# Altium schematic sheet 5_mcu_main.schdoc: EPS MCU Main
size A3; DrawnBy: Sara V. Martínez; Engineer: Flight; DocumentNumber: 6; Revision: V0.1; SheetNumber: 6; SheetTotal: 11; Designed by: Andre M. P. Mattos; ProjectRevision: v0.2
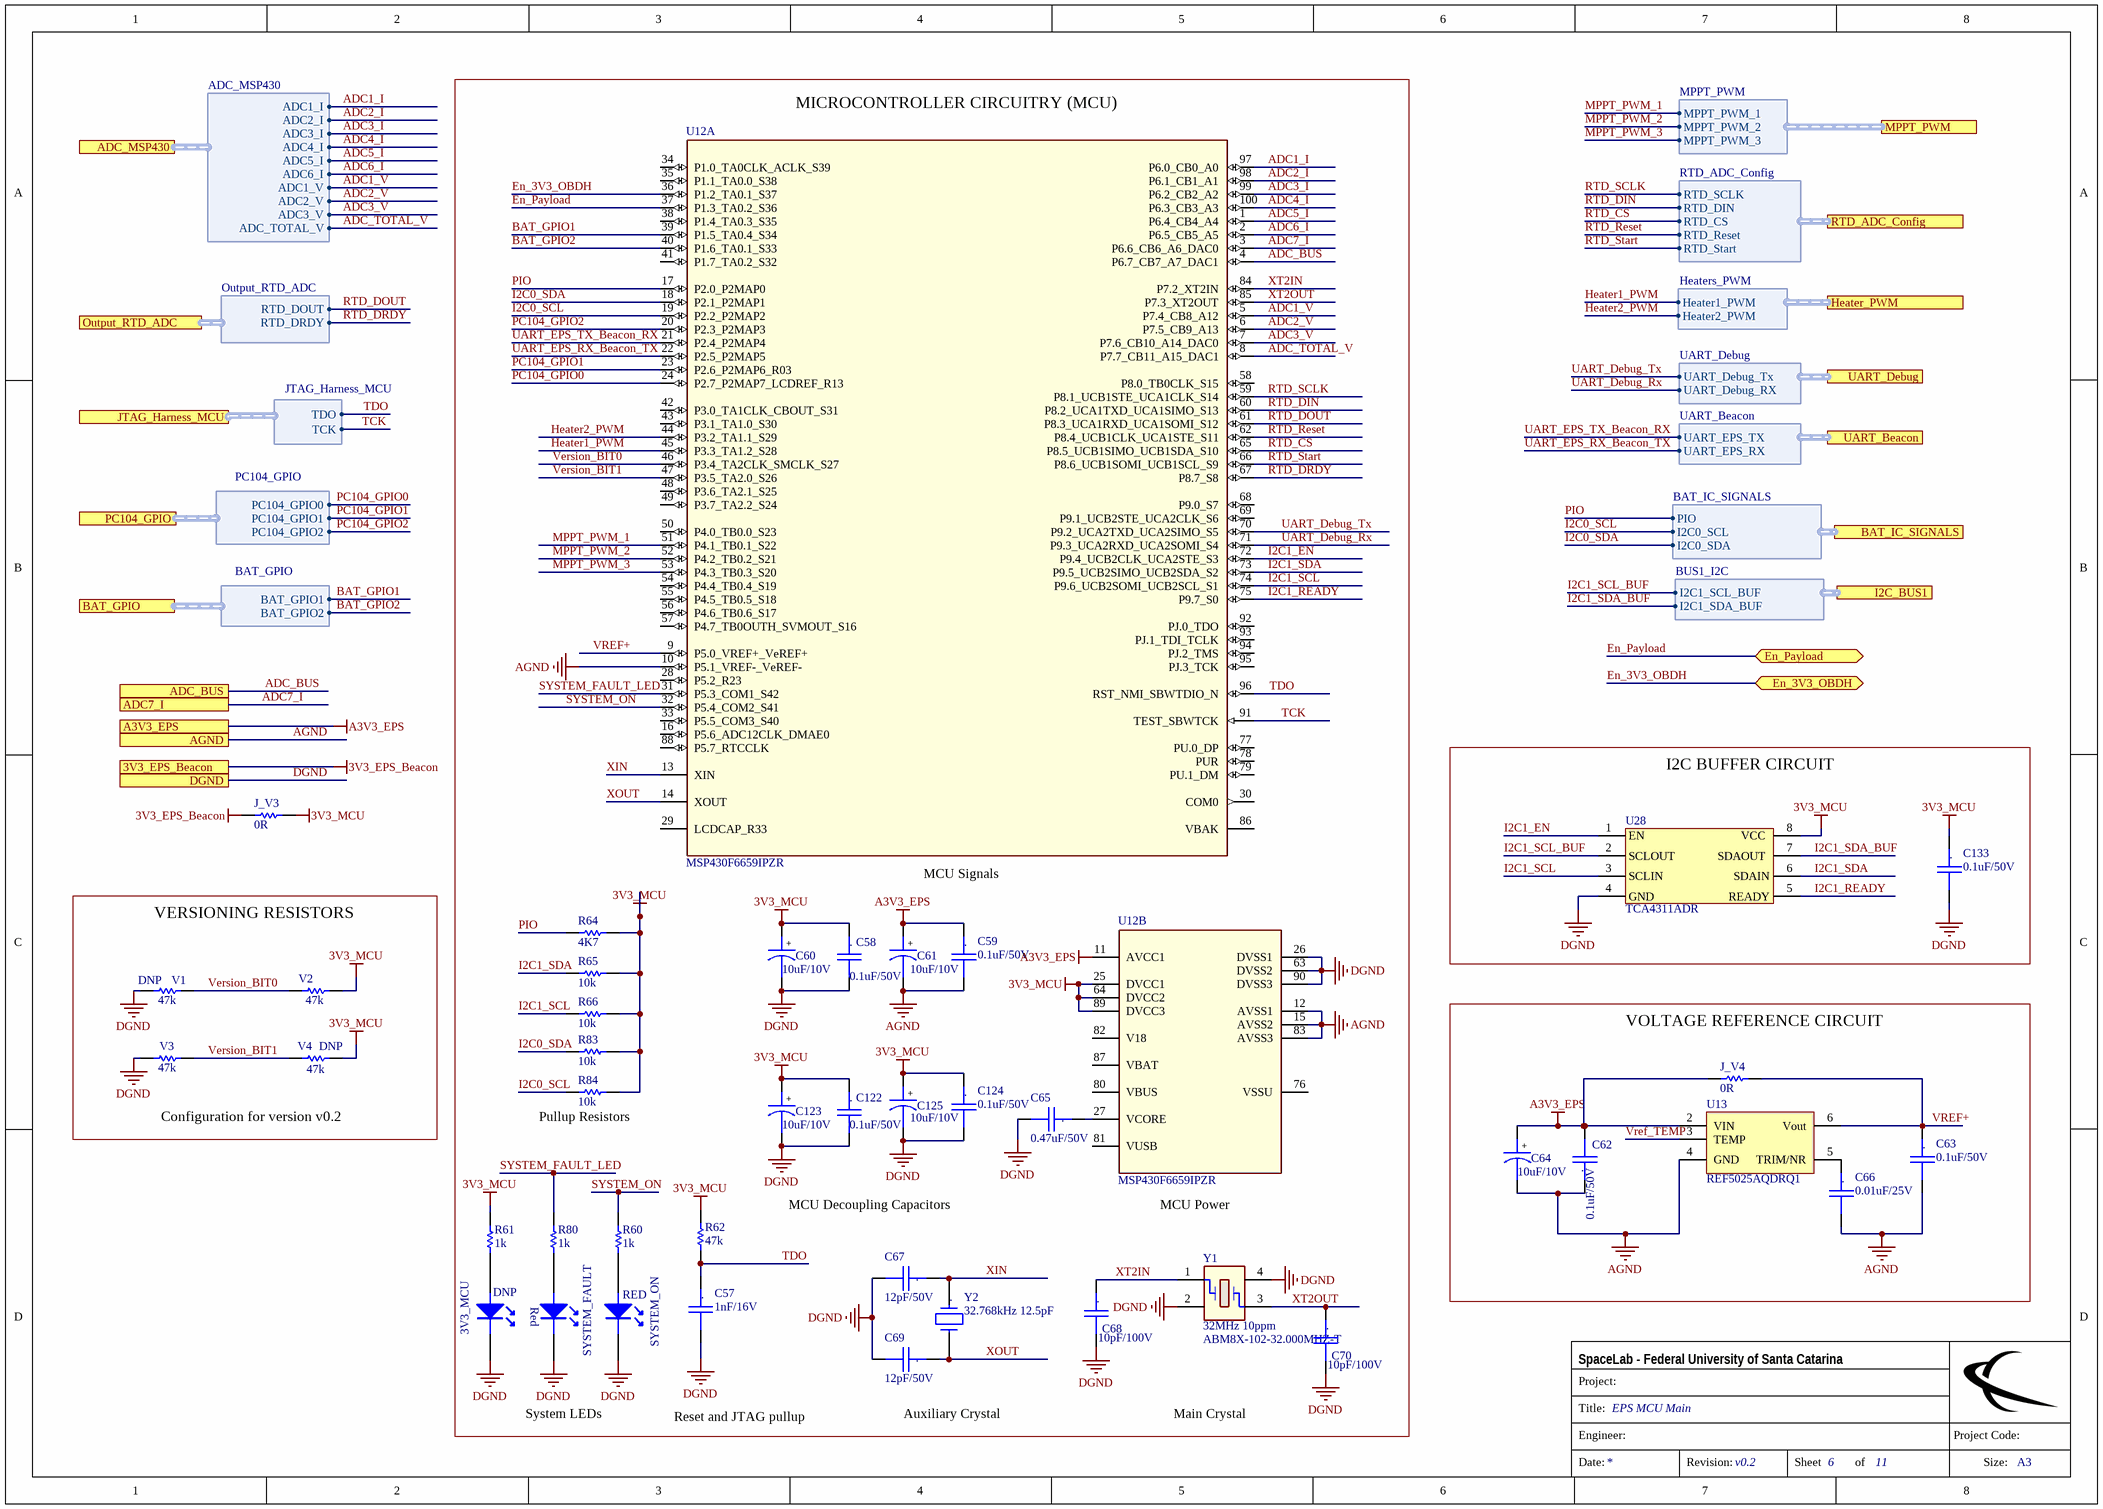
[diagram p0: 5_mcu_main.schdoc]

## Parts
3V3_MCU  DNP  [0603-LED]
C57  1nF/16V  [CC0805]
C58  0.1uF/50V  [CC0603]
C59  0.1uF/50V  [CC0603]
C60  10uF/10V  [CC0805_Tantalum]
C61  10uF/10V  [CC0805_Tantalum]
C62  0.1uF/50V  [CC0805]
C63  0.1uF/50V  [CC0603]
C64  10uF/10V  [CC0805_Tantalum]
C65  0.47uF/50V  [CC0603]
C66  0.01uF/25V  [CC0603]
C67  12pF/50V  [CC0603]
C68  10pF/100V  [CC0805]
C69  12pF/50V  [CC0603]
C70  10pF/100V  [CC0805]
C122  0.1uF/50V  [CC0603]
C123  10uF/10V  [CC0805_Tantalum]
C124  0.1uF/50V  [CC0603]
C125  10uF/10V  [CC0805_Tantalum]
C133  0.1uF/50V  [CC0603]
J_V3  0R  [0805]
J_V4  0R  [0805]
R60  1k  [0603]
R61  1k  [0603]
R62  47k  [0603]
R64  4K7  [0603]
R65  10k  [R0603]
R66  10k  [R0603]
R80  1k  [R0603]
R83  10k  [R0603]
R84  10k  [R0603]
SYSTEM_FAULT  150060RS75000  [0603-RED-LED]  (value not drawn)
SYSTEM_ON  RED  [0603-LED]
U12  MSP430F6659IPZR  [PZ0100A_N]  (parts A,B of 2)
U13  REF5025AQDRQ1  [SOIC-8]
U28  TCA4311ADR  [SOIC8]
V1  47k  [0805]
V2  47k  [0805]
V3  47k  [0805]
V4  47k  [0805]
Y1  32MHz 10ppm  Manufacturer Part Number: ABM8X-102-32.000MHZ-T  [XTAL_ABM8X]
Y2  32.768kHz 12.5pF  [ABS06 0805]

## Blocks framed on the sheet
MICROCONTROLLER CIRCUITRY (MCU): 3V3_MCU C57-C61 C65 C67-C70 C122-C125 R60-R62 R64-R66 R80 R83 R84 SYSTEM_FAULT SYSTEM_ON U12 Y1 Y2
I2C BUFFER CIRCUIT: C133 U28
VERSIONING RESISTORS: V1-V4
VOLTAGE REFERENCE CIRCUIT: C62-C64 C66 J_V4 U13

## Ports
3V3_EPS_Beacon, A3V3_EPS, ADC7_I, ADC_BUS, ADC_MSP430 (harness ADC_MSP430), AGND, BAT_GPIO (harness BAT_GPIO), BAT_IC_SIGNALS (harness BAT_IC_SIGNALS), DGND, En_3V3_OBDH (bidir), En_Payload (bidir), Heater_PWM (harness Heaters_PWM), I2C_BUS1 (harness BUS1_I2C), JTAG_Harness_MCU (harness JTAG_Harness_MCU), MPPT_PWM (harness MPPT_PWM), Output_RTD_ADC (harness Output_RTD_ADC), PC104_GPIO (harness PC104_GPIO), RTD_ADC_Config (harness RTD_ADC_Config), UART_Beacon (harness UART_Beacon), UART_Debug (harness UART_Debug)

## Harnesses
ADC_MSP430: ADC1_I, ADC2_I, ADC3_I, ADC1_V, ADC2_V, ADC3_V, ADC_TOTAL_V, ADC4_I, ADC5_I, ADC6_I
MPPT_PWM: MPPT_PWM_1, MPPT_PWM_2, MPPT_PWM_3
Output_RTD_ADC: RTD_DOUT, RTD_DRDY
RTD_ADC_Config: RTD_SCLK, RTD_DIN, RTD_CS, RTD_Reset, RTD_Start
JTAG_Harness_MCU: TDO, TCK
UART_Debug: UART_Debug_Tx, UART_Debug_RX
BUS1_I2C: I2C1_SCL_BUF, I2C1_SDA_BUF
Heaters_PWM: Heater1_PWM, Heater2_PWM
UART_Beacon: UART_EPS_TX, UART_EPS_RX
PC104_GPIO: PC104_GPIO0, PC104_GPIO1, PC104_GPIO2
BAT_GPIO: BAT_GPIO1, BAT_GPIO2
BAT_IC_SIGNALS: I2C0_SCL, I2C0_SDA, PIO

## Nets
3V3_EPS_Beacon: J_V3.2 ; port 3V3_EPS_Beacon
3V3_MCU: C58.1 C60.1 C122.1 C123.1 C124.1 C125.1 C133.1 J_V3.1 R61.2 R62.2 R64.1 R65.1 R66.1 R83.1 R84.1 U12.25(DVCC1) U12.64(DVCC2) U12.89(DVCC3) U28.8(VCC) V2.1 V4.1
A3V3_EPS: C59.1 C61.1 C62.2 C64.1 J_V4.2 U12.11(AVCC1) U13.2(VIN) ; port A3V3_EPS
AGND: C59.2 C61.2 C62.1 C63.2 C64.2 C66.2 U12.10(P5.1_VREF-_VeREF-) U12.12(AVSS1) U12.15(AVSS2) U12.83(AVSS3) U13.4(GND) ; port AGND
DGND: 3V3_MCU.2(K) C57.2 C58.2 C60.2 C65.2 C67.2 C68.2 C69.2 C70.2 C122.2 C123.2 C124.2 C125.2 C133.2 SYSTEM_FAULT.2(K) SYSTEM_ON.2(K) U12.26(DVSS1) U12.63(DVSS2) U12.90(DVSS3) U28.4(GND) V1.2 V3.2 Y1.2 Y1.4 ; port DGND
ADC1_I: U12.97(P6.0_CB0_A0) ; port ADC_MSP430.ADC1_I
ADC1_V: U12.5(P7.4_CB8_A12) ; port ADC_MSP430.ADC1_V
ADC2_I: U12.98(P6.1_CB1_A1) ; port ADC_MSP430.ADC2_I
ADC2_V: U12.6(P7.5_CB9_A13) ; port ADC_MSP430.ADC2_V
ADC3_I: U12.99(P6.2_CB2_A2) ; port ADC_MSP430.ADC3_I
ADC3_V: U12.7(P7.6_CB10_A14_DAC0) ; port ADC_MSP430.ADC3_V
ADC4_I: U12.100(P6.3_CB3_A3) ; port ADC_MSP430.ADC4_I
ADC5_I: U12.1(P6.4_CB4_A4) ; port ADC_MSP430.ADC5_I
ADC6_I: U12.2(P6.5_CB5_A5) ; port ADC_MSP430.ADC6_I
ADC7_I: U12.3(P6.6_CB6_A6_DAC0) ; port ADC7_I
ADC_BUS: U12.4(P6.7_CB7_A7_DAC1) ; port ADC_BUS
ADC_TOTAL_V: U12.8(P7.7_CB11_A15_DAC1) ; port ADC_MSP430.ADC_TOTAL_V
BAT_GPIO1: U12.39(P1.5_TA0.4_S34) ; port BAT_GPIO.BAT_GPIO1
BAT_GPIO2: U12.40(P1.6_TA0.1_S33) ; port BAT_GPIO.BAT_GPIO2
En_3V3_OBDH: U12.36(P1.2_TA0.1_S37) ; port En_3V3_OBDH
En_Payload: U12.37(P1.3_TA0.2_S36) ; port En_Payload
Heater1_PWM: U12.45(P3.3_TA1.2_S28) ; port Heater_PWM.Heater1_PWM
Heater2_PWM: U12.44(P3.2_TA1.1_S29) ; port Heater_PWM.Heater2_PWM
I2C0_SCL: R84.2 U12.19(P2.2_P2MAP2) ; port BAT_IC_SIGNALS.I2C0_SCL
I2C0_SDA: R83.2 U12.18(P2.1_P2MAP1) ; port BAT_IC_SIGNALS.I2C0_SDA
I2C1_EN: U12.72(P9.4_UCB2CLK_UCA2STE_S3) U28.1(EN)
I2C1_READY: U12.75(P9.7_S0) U28.5(READY)
I2C1_SCL: R66.2 U12.74(P9.6_UCB2SOMI_UCB2SCL_S1) U28.3(SCLIN)
I2C1_SCL_BUF: U28.2(SCLOUT) ; port I2C_BUS1.I2C1_SCL_BUF
I2C1_SDA: R65.2 U12.73(P9.5_UCB2SIMO_UCB2SDA_S2) U28.6(SDAIN)
I2C1_SDA_BUF: U28.7(SDAOUT) ; port I2C_BUS1.I2C1_SDA_BUF
MPPT_PWM_1: U12.51(P4.1_TB0.1_S22) ; port MPPT_PWM.MPPT_PWM_1
MPPT_PWM_2: U12.52(P4.2_TB0.2_S21) ; port MPPT_PWM.MPPT_PWM_2
MPPT_PWM_3: U12.53(P4.3_TB0.3_S20) ; port MPPT_PWM.MPPT_PWM_3
PC104_GPIO0: U12.24(P2.7_P2MAP7_LCDREF_R13) ; port PC104_GPIO.PC104_GPIO0
PC104_GPIO1: U12.23(P2.6_P2MAP6_R03) ; port PC104_GPIO.PC104_GPIO1
PC104_GPIO2: U12.20(P2.3_P2MAP3) ; port PC104_GPIO.PC104_GPIO2
PIO: R64.2 U12.17(P2.0_P2MAP0) ; port BAT_IC_SIGNALS.PIO
RTD_CS: U12.65(P8.5_UCB1SIMO_UCB1SDA_S10) ; port RTD_ADC_Config.RTD_CS
RTD_DIN: U12.60(P8.2_UCA1TXD_UCA1SIMO_S13) ; port RTD_ADC_Config.RTD_DIN
RTD_DOUT: U12.61(P8.3_UCA1RXD_UCA1SOMI_S12) ; port Output_RTD_ADC.RTD_DOUT
RTD_DRDY: U12.67(P8.7_S8) ; port Output_RTD_ADC.RTD_DRDY
RTD_Reset: U12.62(P8.4_UCB1CLK_UCA1STE_S11) ; port RTD_ADC_Config.RTD_Reset
RTD_SCLK: U12.59(P8.1_UCB1STE_UCA1CLK_S14) ; port RTD_ADC_Config.RTD_SCLK
RTD_Start: U12.66(P8.6_UCB1SOMI_UCB1SCL_S9) ; port RTD_ADC_Config.RTD_Start
SYSTEM_FAULT_LED: R80.2 U12.31(P5.3_COM1_S42)
SYSTEM_ON: R60.2 U12.32(P5.4_COM2_S41)
TCK: U12.91(TEST_SBWTCK) ; port JTAG_Harness_MCU.TCK
TDO: C57.1 R62.1 U12.96(RST_NMI_SBWTDIO_N) ; port JTAG_Harness_MCU.TDO
UART_Debug_Rx: U12.71(P9.3_UCA2RXD_UCA2SOMI_S4) ; port UART_Debug.UART_Debug_RX
UART_Debug_Tx: U12.70(P9.2_UCA2TXD_UCA2SIMO_S5) ; port UART_Debug.UART_Debug_Tx
UART_EPS_RX_Beacon_TX: U12.22(P2.5_P2MAP5) ; port UART_Beacon.UART_EPS_RX
UART_EPS_TX_Beacon_RX: U12.21(P2.4_P2MAP4) ; port UART_Beacon.UART_EPS_TX
Version_BIT0: U12.46(P3.4_TA2CLK_SMCLK_S27) V1.1 V2.2
Version_BIT1: U12.47(P3.5_TA2.0_S26) V3.1 V4.2
VREF+: C63.1 J_V4.1 U12.9(P5.0_VREF+_VeREF+) U13.6(Vout)
Vref_TEMP: U13.3(TEMP)
XIN: C67.1 U12.13(XIN) Y2.1
XOUT: C69.1 U12.14(XOUT) Y2.2
XT2IN: C68.1 U12.84(P7.2_XT2IN) Y1.1
XT2OUT: C70.1 U12.85(P7.3_XT2OUT) Y1.3
Net3V3_MCU_1: 3V3_MCU.1(A) R61.1
NetC65_1: C65.1 U12.27(VCORE)
NetC66_1: C66.1 U13.5(TRIM/NR)
NetR60_1: R60.1 SYSTEM_ON.1(A)
NetR80_1: R80.1 SYSTEM_FAULT.1(A)

Not connected (* = marked no-connect by the designer): U12 16(P5.6_ADC12CLK_DMAE0) 28(P5.2_R23) 29(LCDCAP_R33) 30(COM0) 33(P5.5_COM3_S40) 34(P1.0_TA0CLK_ACLK_S39) 35(P1.1_TA0.0_S38) 38(P1.4_TA0.3_S35) 41(P1.7_TA0.2_S32) 42(P3.0_TA1CLK_CBOUT_S31) 43(P3.1_TA1.0_S30) 48(P3.6_TA2.1_S25) 49(P3.7_TA2.2_S24) 50(P4.0_TB0.0_S23) 54(P4.4_TB0.4_S19) 55(P4.5_TB0.5_S18) 56(P4.6_TB0.6_S17) 57(P4.7_TB0OUTH_SVMOUT_S16) 58(P8.0_TB0CLK_S15) 68(P9.0_S7) 69(P9.1_UCB2STE_UCA2CLK_S6) 76(VSSU) 77(PU.0_DP) 78(PUR) 79(PU.1_DM) 80(VBUS) 81(VUSB) 82(V18) 86(VBAK) 87(VBAT) 88(P5.7_RTCCLK) 92(PJ.0_TDO) 93(PJ.1_TDI_TCLK) 94(PJ.2_TMS) 95(PJ.3_TCK)

## Notes on the sheet
- MCU Signals
- (near V1) DNP
- (near V4) DNP
- Configuration for version v0.2
- (near R84) Pullup Resistors
- MCU Decoupling Capacitors
- MCU Power
- System LEDs
- Reset and JTAG pullup
- Auxiliary Crystal
- Main Crystal
- Project:
- SpaceLab - Federal University of Santa Catarina
- Title:
- Engineer:
- Project Code:
- Date:
- Revision:
- Sheet
- of
- Size:
- A3
- (in symbol Cap_Cer_X7R_0.01uF_25V_0603) .
- (in symbol Cap_Cer_X7R_0.1uF_50V_0603) .
- (in symbol Cap_Cer_X7R_0.1uF_50V_0805) .
- (in symbol Cap_Cer_X7R_0.47uF_50V_0603) .
- (in symbol Cap_Cer_X7R_1nF_16V_0603) .
- (in symbol Cap_Cer_X7R_10pF_100V_0805) .
- (in symbol Cap_Cer_X7R_12pF_50V_0603) .
- (in symbol Cap_Tant_SMD_10uF_6V3_0805) +
- (in symbol LED/R_0602) Red
- (in symbol Xtal_32.768kHz_12pF_2_SMD) .

## Library data of the parts
3V3_MCU = LED/G_0603: SMD Green LED; Partnumber: 150060VS75000; Manufacturer: Wurth Electronics; Dominant Wavelength: 570nm; Forward Current: 30mA; Forward Voltage: 2V; Lens Style: Clear,Rectangular; Luminous Intensity: 40mcd; Test Current: 20mA; Viewing Angle: 140°; NCM: 8541.40.21; Case/Package: 0603; Case Code (Imperial): 0603; Case Code (Metric): 1608; Color: Green; ComponentLink1Description: https://katalog.we-online.de/led/datasheet/150060VS75000.pdf?src-supplier=Digi-Key; ComponentLink1URL: https://katalog.we-online.de/led/datasheet/150060VS75000.pdf?src-supplier=Digi-Key; Height: 0.7mm; Length: 1.6mm; Manufacturer Part Number: 150060VS75000; Max Operating Temperature: 85°C; Min Operating Temperature: -40°C; Mount: Surface Mount; Number of Pins: 2; Package Quantity: 1; Packaging: Tape and Reel; Pricing 1: 1=0.14, 10=0.138, 25=0.138, 50=0.129, 100=0.11, 250=0.11 (USD); Pricing 2: 1=0.14, 50=0.133, 100=0.114, 500=0.099 (USD); REACH SVHC: Unknown; Stock 1: 16336; Stock 2: 31910; Supplier 1: Mouser; Supplier 2: Digi-Key; Supplier Part Number 1: 710-150060VS75000; Supplier Part Number 2: 732-4980-1-ND; Wavelength: 570nm; Width: 0.8mm
C57 = Cap_Cer_X7R_1nF_16V_0603: CAP CER 1nF 16V 0603 5%; Partnumber: C0603X102J4RECAUTO; Manufacturer: KEMET; NCM: 8532.24.10; Capacitance: 1nF; Case/Package: 0603; Case Code (Imperial): 0603; Case Code (Metric): 1608; ComponentLink1Description: http://www.farnell.com/datasheets/2743686.pdf?src-supplier=Farnell; ComponentLink1URL: http://www.farnell.com/datasheets/2743686.pdf?src-supplier=Farnell; ComponentLink2Description: https://api.kemet.com/component-edge/download/datasheet/C0603X102J4RECAUTO.pdf?src-supplier=Digi-Key; ComponentLink2URL: https://api.kemet.com/component-edge/download/datasheet/C0603X102J4RECAUTO.pdf?src-supplier=Digi-Key; ComponentLink3Description: http://www.farnell.com/datasheets/2743686.pdf?src-supplier=Newark; ComponentLink3URL: http://www.farnell.com/datasheets/2743686.pdf?src-supplier=Newark; Features: Soft Termination; Manufacturer Part Number: C0603X102J4RECAUTO; Max Operating Temperature: 125°C; Min Operating Temperature: -55°C; Mount: Surface Mount; Packaging: Tape and Reel; Pricing 1: 1=0.24, 10=0.161, 100=0.081, 500=0.055, 1000=0.049, 4000=0.037 (USD); Pricing 2: 1=0.23, 10=0.154, 50=0.0926, 100=0.0781, 500=0.05346, 1000=0.04729 (USD); Ratings: AEC-Q200; Stock 1: 4509; Stock 2: 7106; Supplier 1: Mouser; Supplier 2: Digi-Key; Supplier Part Number 1: 80-C0603X102J4RECAUT; Supplier Part Number 2: 399-17840-1-ND; Tolerance: 5%; Voltage Rating: 16V
C58 C59 C63 C122 C124 C133 = Cap_Cer_X7R_0.1uF_50V_0603: CAP CER 0.1UF 50V 10% X7R 0603; Partnumber: CC0603KPX7R9BB104; Manufacturer: Yageo; Capacitance: 100nF; Supplier 1: Mouser; Supplier Part Number 1: 603-CC603KPX7R9BB104; Stock 1: 5712768; Pricing 1: 1=0.1, 10=0.065, 100=0.02, 1000=0.016, 2500=0.013, 10000=0.01 (USD); Mount: Surface Mount; Case/Package: 0603; Number of Pins: 2; Weight: 7.1E-05oz; Case Code (Imperial): 0603; Case Code (Metric): 1608; Min Operating Temperature: -55°C; Max Operating Temperature: 125°C; Tolerance: 10%; Dielectric: X7R; Packaging: Tape and Reel; Voltage Rating (DC): 50V; Voltage Rating: 50V; Termination: SMD/SMT; Composition: Ceramic; Length: 1.6mm; Height: 0.8mm; Width: 0.031inch; Thickness: 0.035inch; Depth: 0.8mm; Radiation Hardening: No; Lead Free: Lead Free; Halogen Free: Halogen Free; ComponentLink1URL: https://www.verical.com/server-webapp/html/getDatasheet?partID=653026&src-supplier=Verical; ComponentLink1Description: https://www.verical.com/server-webapp/html/getDatasheet?partID=653026&src-supplier=Verical; Supplier 2: Digi-Key; Supplier Part Number 2: 311-3567-1-ND; Stock 2: 0; Pricing 2: 1=0.1, 10=0.066, 50=0.036, 100=0.0293, 500=0.02094, 1000=0.01646, 2500=0.01496, 5000=0.01376 (USD); Manufacturer Part Number: CC0603KPX7R9BB104
C60 C61 C64 C123 C125 = Cap_Tant_SMD_10uF_6V3_0805: CAP Tantalum 10uF 6.3V 10% 0805; Partnumber: TPSR106K006R1000; Manufacturer: Kyocera AVX; Dissipation Factor: 8%; ESR (Equivalent Series Resistance): 1R; Polarity: Polar; NCM: 8532.21.11; Capacitance: 10uF; Case/Package: 0805; Case Code (Imperial): 0805; Case Code (Metric): 2012; ComponentLink1Description: http://www.avx.com/docs/Catalogs/packmark.pdf?src-supplier=Element14; ComponentLink1URL: http://www.avx.com/docs/Catalogs/packmark.pdf?src-supplier=Element14; ComponentLink2Description: http://www.farnell.com/datasheets/1441576.pdf?src-supplier=Element14; ComponentLink2URL: http://www.farnell.com/datasheets/1441576.pdf?src-supplier=Element14; ComponentLink3Description: http://datasheets.avx.com/TPS.pdf?src-supplier=Digi-Key; ComponentLink3URL: http://datasheets.avx.com/TPS.pdf?src-supplier=Digi-Key; Depth: 1.3mm; Dielectric Material: Tantalum; Features: General Purpose; Height - Seated (Max): 0.047inch; Height: 1.2mm; Lead Free: Lead Free; Length: 2.05mm; Manufacturer Part Number: TPSR106K006R1000; Max Operating Temperature: 125°C; Min Operating Temperature: -55°C; Mount: Surface Mount; Package Quantity: 1; Packaging: Tape and Reel; Pricing 1: 1=0.76, 10=0.561, 100=0.384, 500=0.304, 1000=0.256, 2500=0.237 (USD); Pricing 2: 1=0.73, 10=0.536, 50=0.429, 100=0.3678, 500=0.29114, 1000=0.24517 (USD); Radiation Hardening: No; REACH SVHC: No SVHC; Stock 1: 0; Stock 2: 0; Supplier 1: Mouser; Supplier 2: Digi-Key; Supplier Part Number 1: 581-TPSR106K006R1000; Supplier Part Number 2: 478-9265-1-ND; Termination: SMD/SMT; Tolerance: 10%; Voltage Rating: 6.3V; Width: 0.051inch
C62 = Cap_Cer_X7R_0.1uF_50V_0805: CAP CER 0.1UF 50V 10% X7R 0805; Partnumber: CC0805KRX7R9BB104; Manufacturer: Yageo; Material: Ceramic; Capacitance: 100nF; Insulation Resistance: 100GR; Supplier 1: Mouser; Supplier Part Number 1: 603-CC805KRX7R9BB104; Stock 1: 3904445; Pricing 1: 1=0.12, 10=0.087, 100=0.028, 1000=0.023, 4000=0.018, 8000=0.017 (USD); Mount: Surface Mount; Case/Package: 0805; Number of Pins: 2; Case Code (Metric): 2012; Case Code (Imperial): 0805; Min Operating Temperature: -55°C; Max Operating Temperature: 125°C; Tolerance: 10%; Dielectric: X7R; Packaging: Tape and Reel; Voltage Rating: 50V; Package Quantity: 1; Termination: SMD/SMT; Voltage: 50V; Length: 2mm; Height: 0.85mm; Depth: 1.25mm; Width: 0.049inch; Thickness: 0.033inch; Radiation Hardening: No; REACH SVHC: No SVHC; Lead Free: Lead Free; Halogen Free: Halogen Free; ComponentLink1URL: http://www.yageo.com/documents/recent/UPY-GPHC_X7R_6.3V-to-50V_8.pdf?src-supplier=Avnet; ComponentLink1Description: http://www.yageo.com/documents/recent/UPY-GPHC_X7R_6.3V-to-50V_8.pdf?src-supplier=Avnet; ComponentLink2URL: http://www.farnell.com/datasheets/1489800.pdf?src-supplier=Element14; ComponentLink2Description: http://www.farnell.com/datasheets/1489800.pdf?src-supplier=Element14; ComponentLink3URL: http://www.yageo.com/documents/recent/UPY-GPHC_X7R_6.3V-to-50V_18.pdf?src-supplier=Digi-Key; ComponentLink3Description: http://www.yageo.com/documents/recent/UPY-GPHC_X7R_6.3V-to-50V_18.pdf?src-supplier=Digi-Key; ComponentLink4URL: http://www.farnell.com/datasheets/2167236.pdf?src-supplier=Element14; ComponentLink4Description: http://www.farnell.com/datasheets/2167236.pdf?src-supplier=Element14; ComponentLink5URL: http://www.yageo.com/documents/recent/UPY-GPHC_X7R_6.3V-to-50V_8.pdf?src-supplier=Avnet+Europe; ComponentLink5Description: http://www.yageo.com/documents/recent/UPY-GPHC_X7R_6.3V-to-50V_8.pdf?src-supplier=Avnet+Europe; ComponentLink6URL: http://www.produktinfo.conrad.com/datenblaetter/425000-449999/445210-da-01-en-KERKO_CHIP_0805_X7R_0_1uF_10Proz_50VG.pdf?src-supplier=Conrad; ComponentLink6Description: http://www.produktinfo.conrad.com/datenblaetter/425000-449999/445210-da-01-en-KERKO_CHIP_0805_X7R_0_1uF_10Proz_50VG.pdf?src-supplier=Conrad; Supplier 2: Digi-Key; Supplier Part Number 2: 311-1140-1-ND; Stock 2: 544494; Pricing 2: 1=0.12, 10=0.088, 50=0.05, 100=0.0414, 500=0.02906, 1000=0.02405 (USD); Manufacturer Part Number: CC0805KRX7R9BB104
C65 = Cap_Cer_X7R_0.47uF_50V_0603: CAP CER 0.47UF 50V 10% X7R 0603; Partnumber: C1608X7R1H474K080AE; Manufacturer: TDK; Capacitance: 470nF; NCM: 8532.24.10; Case/Package: 0603; Case Code (Imperial): 0603; Case Code (Metric): 1608; ComponentLink1Description: http://www.mouser.com/ds/2/400/tdk_mlcc_commercial_general_en-542463.pdf?src-supplier=Mouser; ComponentLink1URL: http://www.mouser.com/ds/2/400/tdk_mlcc_commercial_general_en-542463.pdf?src-supplier=Mouser; ComponentLink2Description: https://product.tdk.com/info/en/catalog/datasheets/mlcc_commercial_soft_en.pdf?src-supplier=Digi-Key; ComponentLink2URL: https://product.tdk.com/info/en/catalog/datasheets/mlcc_commercial_soft_en.pdf?src-supplier=Digi-Key; ComponentLink3Description: https://product.tdk.com/info/en/catalog/spec/mlccspec_commercial_soft_en.pdf?src-supplier=Digi-Key; ComponentLink3URL: https://product.tdk.com/info/en/catalog/spec/mlccspec_commercial_soft_en.pdf?src-supplier=Digi-Key; Dielectric: X7R; Features: Soft Termination; Height: 0.8mm; Lead Free: Lead Free; Length: 0.063inch; Manufacturer Part Number: C1608X7R1H474K080AE; Max Operating Temperature: 125°C; Min Operating Temperature: -55°C; Mount: Surface Mount; Package Quantity: 4000; Packaging: Tape and Reel; Pricing 1: 1=0.35, 10=0.24, 100=0.144, 500=0.108, 1000=0.091, 4000=0.077 (USD); Pricing 2: 1=0.33, 10=0.23, 50=0.161, 100=0.1379, 500=0.10346, 1000=0.08736 (USD); Stock 1: 82530; Stock 2: 9176; Supplier 1: Mouser; Supplier 2: Digi-Key; Supplier Part Number 1: 810-C1608X7R1H474K0E; Supplier Part Number 2: 445-172485-1-ND; Termination: SMD/SMT; Thickness: 0.037inch; Tolerance: 10%; Voltage Rating (DC): 50V; Voltage Rating: 50V; Weight: 7.1E-05oz; Width: 0.8mm
C66 = Cap_Cer_X7R_0.01uF_25V_0603: CAP CER 0.01UF 25V 5% X7R 0603; Partnumber: 06033C103JAT4A; Manufacturer: Kyocera AVX; Capacitance: 10nF; NCM: 8532.24.10; Case/Package: 0603; Case Code (Imperial): 0603; Case Code (Metric): 1608; ComponentLink1Description: http://datasheets.avx.com/X7RDielectric.pdf?src-supplier=Digi-Key; ComponentLink1URL: http://datasheets.avx.com/X7RDielectric.pdf?src-supplier=Digi-Key; ComponentLink2Description: http://www.mouser.com/ds/2/40/X7RDielectric-777024.pdf?src-supplier=Mouser; ComponentLink2URL: http://www.mouser.com/ds/2/40/X7RDielectric-777024.pdf?src-supplier=Mouser; Depth: 0.81mm; Dielectric: X7R; Length: 1.6mm; Manufacturer Part Number: 06033C103JAT4A; Max Operating Temperature: 125°C; Min Operating Temperature: -55°C; Mount: Surface Mount; Number of Pins: 2; Package Quantity: 15000; Packaging: Tape and Reel; Pricing 1: 1=0.11, 10=0.078, 100=0.034, 500=0.033, 1000=0.033, 2500=0.033 (USD); Pricing 2: 1=0.1, 10=0.075, 50=0.0406, 100=0.0332, 500=0.02372, 1000=0.01863, 2500=0.01694, 5000=0.01558 (USD); Radiation Hardening: No; Stock 1: 13176; Stock 2: 28613; Supplier 1: Mouser; Supplier 2: Digi-Key; Supplier Part Number 1: 581-06033C103JAT4A; Supplier Part Number 2: 478-12681-1-ND; Termination: SMD/SMT; Thickness: 0.035inch; Tolerance: 5%; Voltage Rating (DC): 25V; Voltage Rating: 25V; Width: 0.032inch
C67 C69 = Cap_Cer_X7R_12pF_50V_0603: CAP CER 12pF 50V 0603; Partnumber: GQM1885C1H120GB01D; Manufacturer: Murata; Dielectric: C0G; Tolerance: 2%; NCM: 8532.24.10; Capacitance: 12pF; Case/Package: 0603; Case Code (Imperial): 0603; Case Code (Metric): 1608; ComponentLink1Description: http://psearch.murata.com/capacitor/product/GQM1885C1H120GB01%23.pdf?src-supplier=Avnet; ComponentLink1URL: http://psearch.murata.com/capacitor/product/GQM1885C1H120GB01%23.pdf?src-supplier=Avnet; ComponentLink2Description: http://search.murata.co.jp/Ceramy/image/img/A01X/partnumbering_e_01.pdf?src-supplier=Digi-Key; ComponentLink2URL: http://search.murata.co.jp/Ceramy/image/img/A01X/partnumbering_e_01.pdf?src-supplier=Digi-Key; Depth: 0.8mm; Height: 0.8mm; Length: 1.6mm; Manufacturer Part Number: GQM1885C1H120GB01D; Max Operating Temperature: 125°C; Min Operating Temperature: -55°C; Mount: Surface Mount; Package Quantity: 4000; Packaging: Tape and Reel; Pricing 1: 1=0.92, 10=0.703, 100=0.502, 250=0.475, 500=0.389, 1000=0.335 (USD); Pricing 2: 1=0.8, 10=0.611, 50=0.5078, 100=0.4373, 500=0.33858 (USD); Radiation Hardening: No; Stock 1: 3119; Stock 2: 550; Supplier 1: Mouser; Supplier 2: Digi-Key; Supplier Part Number 1: 81-GQM1885C1H120GB01; Supplier Part Number 2: 490-11261-1-ND; Termination: SMD/SMT; Thickness: 0.035inch; Voltage Rating (DC): 50V; Voltage Rating: 50V; Width: 0.031inch
C68 C70 = Cap_Cer_X7R_10pF_100V_0805: CAP CER 10pF 100V 0805; Partnumber: 08051A100FAT2A; Manufacturer: Kyocera AVX; Dielectric: C0G; Dissipation Factor: 10%; Tolerance: 1%; NCM: 8532.24.10; Capacitance: 10pF; Case/Package: 0805; Case Code (Imperial): 0805; Case Code (Metric): 2012; ComponentLink1Description: http://www.mouser.com/ds/2/40/C0GNP0-Dielectric-951274.pdf?src-supplier=Mouser; ComponentLink1URL: http://www.mouser.com/ds/2/40/C0GNP0-Dielectric-951274.pdf?src-supplier=Mouser; ComponentLink2Description: http://www.farnell.com/datasheets/1796416.pdf?src-supplier=Element14; ComponentLink2URL: http://www.farnell.com/datasheets/1796416.pdf?src-supplier=Element14; ComponentLink3Description: http://datasheets.avx.com/C0GNP0-Dielectric.pdf?src-supplier=Digi-Key; ComponentLink3URL: http://datasheets.avx.com/C0GNP0-Dielectric.pdf?src-supplier=Digi-Key; ComponentLink4Description: http://catalogs.avx.com/SurfaceMount.pdf?src-supplier=Digi-Key; ComponentLink4URL: http://catalogs.avx.com/SurfaceMount.pdf?src-supplier=Digi-Key; ComponentLink5Description: http://www.avxcorp.com/docs/Catalogs/ccog.pdf?src-supplier=Avnet+Europe; ComponentLink5URL: http://www.avxcorp.com/docs/Catalogs/ccog.pdf?src-supplier=Avnet+Europe; Contact Plating: Tin,Matte; Depth: 1.25mm; Height: 0.94mm; Lead Free: Lead Free; Length: 2.01mm; Manufacturer Part Number: 08051A100FAT2A; Max Operating Temperature: 125°C; Min Operating Temperature: -55°C; Mount: Surface Mount; Number of Pins: 2; Package Quantity: 4000; Packaging: Tape and Reel; Pricing 1: 1=0.39, 10=0.274, 100=0.164, 500=0.123, 1000=0.104, 2000=0.097 (USD); Pricing 2: 1=0.49, 10=0.347, 50=0.2626, 100=0.2287, 500=0.1694, 1000=0.14399 (USD); Radiation Hardening: No; REACH SVHC: No SVHC; Stock 1: 12105; Stock 2: 18206; Supplier 1: Mouser; Supplier 2: Digi-Key; Supplier Part Number 1: 581-08051A100FAT2A; Supplier Part Number 2: 478-5779-1-ND; Termination: SMD/SMT; Thickness: 0.037inch; Voltage Rating (DC): 100V; Voltage Rating: 100V; Width: 1.25mm
J_V3 J_V4 = R0R_JUMPER_1/8W_0805: RES 0R OHM 1/8W JUMPER 0805; Partnumber: CRCW08050000Z0EA; Manufacturer: Vishay; Max Power Dissipation: 125mW; Resistance: 0mR; Temperature Coefficient: 100ppm/°C; Tolerance: 1%; Voltage Rating (DC): 150V; Fitted: No (jumper resistor); Case/Package: 0805; Case Code (Imperial): 0805; Case Code (Metric): 2012; ComponentLink1Description: http://www.vishay.com/docs/20035/dcrcwe3.pdf?src-supplier=Avnet+Europe; ComponentLink1URL: http://www.vishay.com/docs/20035/dcrcwe3.pdf?src-supplier=Avnet+Europe; ComponentLink2Description: http://www.vishay.com/docs/20035/dcrcwe3.pdf?src-supplier=Distrelec; ComponentLink2URL: http://www.vishay.com/docs/20035/dcrcwe3.pdf?src-supplier=Distrelec; ComponentLink3Description: http://www.vishay.com/docs/20035/dcrcwe3.pdf?src-supplier=Mouser; ComponentLink3URL: http://www.vishay.com/docs/20035/dcrcwe3.pdf?src-supplier=Mouser; ComponentLink4Description: http://uk.rs-online.com/webdocs/0d98/0900766b80d98b26.pdf?src-supplier=RSComponents; ComponentLink4URL: http://uk.rs-online.com/webdocs/0d98/0900766b80d98b26.pdf?src-supplier=RSComponents; ComponentLink5Description: http://www.vishay.com/docs/20035/dcrcwe3.pdf?src-supplier=Future+Electronics; ComponentLink5URL: http://www.vishay.com/docs/20035/dcrcwe3.pdf?src-supplier=Future+Electronics; ComponentLink6Description: http://www.vishay.com/docs/20035/dcrcwe3.pdf?src-supplier=Allied+Electronics; ComponentLink6URL: http://www.vishay.com/docs/20035/dcrcwe3.pdf?src-supplier=Allied+Electronics; ComponentLink7Description: http://www.vishay.com/docs/20035/dcrcwe3.pdf?src-supplier=Digi-Key; ComponentLink7URL: http://www.vishay.com/docs/20035/dcrcwe3.pdf?src-supplier=Digi-Key; ComponentLink8Description: http://www.farnell.com/datasheets/2310790.pdf?src-supplier=Element14; ComponentLink8URL: http://www.farnell.com/datasheets/2310790.pdf?src-supplier=Element14; Composition: Thick Film; Contact Plating: Tin,Lead; Depth: 1.25mm; Features: Automotive AEC-Q200; Height: 0.45mm; Lead Free: Lead Free; Length: 2mm; Manufacturer Part Number: CRCW08050000Z0EA; Max Operating Temperature: 155°C; Military Standard: Not; Min Operating Temperature: -55°C; Number of Terminations: 2; Package Quantity: 1; Packaging: Tape and Reel; Power Rating: 125mW; Pricing 1: 1=0.1, 10=0.024, 100=0.01, 1000=0.007, 5000=0.004, 10000=0.004 (USD); Pricing 2: 1=0.1, 10=0.04, 25=0.0288, 50=0.022, 100=0.0162, 250=0.01236, 500=0.0099, 1000=0.00729 (USD); Radiation Hardening: No; REACH SVHC: Unknown; Stock 1: 903478; Stock 2: 399530; Supplier 1: Mouser; Supplier 2: Digi-Key; Supplier Part Number 1: 71-CRCW0805-0-E3; Supplier Part Number 2: 541-0.0ADKR-ND; Termination: SMD/SMT; Voltage Rating: 150V; Weight: 0.000194oz; Width: 1.25mm
R60 R61 = R1.0k_1%_1/8W_0603: RES 1.0K OHM 1/8W 1% 0603; Partnumber: MCT06030C1001FP500; Manufacturer: Vishay; Max Power Dissipation: 125mW; Power Rating: 100mW; Resistance: 1kR; Temperature Coefficient: 50ppm/°C; Voltage Rating (DC): 75V; NCM: 8533.21.20; Case/Package: 0603; Case Code (Imperial): 0603; Case Code (Metric): 1608; ComponentLink1Description: http://www.vishay.com/docs/28705/mcx0x0xpro.pdf?src-supplier=Digi-Key; ComponentLink1URL: http://www.vishay.com/docs/28705/mcx0x0xpro.pdf?src-supplier=Digi-Key; ComponentLink2Description: http://www.vishay.com/docs/28705/mc_pro.pdf?src-supplier=Avnet+Europe; ComponentLink2URL: http://www.vishay.com/docs/28705/mc_pro.pdf?src-supplier=Avnet+Europe; ComponentLink3Description: http://www.vishay.com/docs/28705/mc_pro.pdf?src-supplier=Avnet; ComponentLink3URL: http://www.vishay.com/docs/28705/mc_pro.pdf?src-supplier=Avnet; ComponentLink4Description: http://www.vishay.com/docs/28705/mc_pro.pdf?src-supplier=Future+Electronics; ComponentLink4URL: http://www.vishay.com/docs/28705/mc_pro.pdf?src-supplier=Future+Electronics; Composition: Thin Film; Contact Plating: Tin; Depth: 0.85mm; Height: 0.022inch; Lead Free: Lead Free; Length: 1.55mm; Manufacturer Part Number: MCT06030C1001FP500; Max Operating Temperature: 125°C; Military Standard: Not; Min Operating Temperature: -55°C; Mount: Surface Mount; Number of Terminations: 2; Package Quantity: 1; Packaging: Tape and Reel; Pricing 1: 1=0.1, 1000=0.025, 2000=0.023, 5000=0.019, 10000=0.018, 20000=0.017 (USD); Pricing 2: 1=0.17, 10=0.145, 100=0.0568, 1000=0.02376, 2500=0.02178 (USD); Radiation Hardening: No; REACH SVHC: Unknown; Stock 1: 142157; Stock 2: 268907; Supplier 1: Mouser; Supplier 2: Digi-Key; Supplier Part Number 1: 594-MCT06030C1001FP5; Supplier Part Number 2: MCT0603-1.00K-CFCT-ND; Termination: SMD/SMT; Tolerance: 1%; Voltage Rating: 75V; Weight: 7.1E-05oz; Width: 0.033inch
R62 = R47k_1%_1/8W_0603: RES 47K OHM 1/8W 0.5% 0603; Partnumber: MCT0603MD4702DP500; Manufacturer: Vishay; Max Power Dissipation: 150mW; Power Rating: 125mW; Resistance: 47kR; Temperature Coefficient: 25ppm/°C; Voltage Rating (DC): 75V; NCM: 8533.21.20; Case/Package: 0603; Case Code (Imperial): 0603; Case Code (Metric): 1608; ComponentLink1Description: http://www.farnell.com/datasheets/360042.pdf?src-supplier=Farnell; ComponentLink1URL: http://www.farnell.com/datasheets/360042.pdf?src-supplier=Farnell; ComponentLink2Description: http://www.vishay.com/docs/28760/mcat_pro.pdf?src-supplier=Digi-Key; ComponentLink2URL: http://www.vishay.com/docs/28760/mcat_pro.pdf?src-supplier=Digi-Key; Composition: Thin Film; Features: Automotive AEC-Q200,Anti-Sulfur; Height: 0.022inch; Length: 0.061inch; Manufacturer Part Number: MCT0603MD4702DP500; Max Operating Temperature: 175°C; Min Operating Temperature: -55°C; Number of Pins: 2; Number of Terminations: 2; Package Quantity: 1; Packaging: Tape and Reel; Pricing 1: 1=0.39, 10=0.224, 100=0.12, 500=0.096, 1000=0.072, 2500=0.062 (USD); Pricing 2: 1=0.41, 10=0.294, 100=0.1176, 1000=0.05797, 2500=0.05371 (USD); REACH SVHC: No SVHC; Stock 1: 1149; Stock 2: 4275; Supplier 1: Mouser; Supplier 2: Digi-Key; Supplier Part Number 1: 594-MCT0603MD4702DP5; Supplier Part Number 2: MCT0603-47K-MDCT-ND; Termination: SMD/SMT; Tolerance: 0.5%; Voltage Rating: 75V; Weight: 7.1E-05oz; Width: 0.8mm
R64 = R4.7K_1%_1/8W_0603: RES 4K7 OHM 1/8W 1% 0603; Manufacturer: Vishay Beyschlag; Manufacturer Part Number: MCT06030C4701FP500; Max Power Dissipation: 125mW; Resistance: 4.7kR; Temperature Coefficient: 50ppm/°C; Voltage Rating (DC): 75V; Case/Package: 0603; Case Code (Imperial): 0603; Case Code (Metric): 1608; ComponentLink1Description: http://www.vishay.com/docs/28705/mc_pro.pdf?src-supplier=Avnet; ComponentLink1URL: http://www.vishay.com/docs/28705/mc_pro.pdf?src-supplier=Avnet; ComponentLink2Description: http://www.vishay.com/docs/28705/mc_pro.pdf?src-supplier=Future+Electronics; ComponentLink2URL: http://www.vishay.com/docs/28705/mc_pro.pdf?src-supplier=Future+Electronics; ComponentLink3Description: http://www.vishay.com/docs/28705/mcx0x0xpro.pdf?src-supplier=Digi-Key; ComponentLink3URL: http://www.vishay.com/docs/28705/mcx0x0xpro.pdf?src-supplier=Digi-Key; Composition: Thin Film; Contact Plating: Tin; Depth: 0.85mm; Height: 0.022inch; Lead Free: Lead Free; Length: 1.55mm; Max Operating Temperature: 125°C; Military Standard: Not; Min Operating Temperature: -55°C; Mount: Surface Mount; Number of Terminations: 2; Package Quantity: 1; Packaging: Tape and Reel; Power Rating: 125mW; Pricing 1: 1=0.16, 50=0.076, 100=0.06, 500=0.034, 1000=0.023, 5000=0.019 (USD); Pricing 2: 1=0.17, 10=0.145, 100=0.0568, 1000=0.02376, 2500=0.02178 (USD); Radiation Hardening: No; REACH SVHC: No SVHC; Stock 1: 126399; Stock 2: 38031; Supplier 1: Mouser; Supplier 2: Digi-Key; Supplier Part Number 1: 594-MCT06030C4701FP5; Supplier Part Number 2: MCT0603-4.70K-CFCT-ND; Tolerance: 1%; Voltage Rating: 75V; Width: 0.033inch; Partnumber: MCT06030C4701FP500
R65 R66 R83 R84 = R10k_1%_1/8W_0603: RES 10K OHM 1/8W 1%  0603; Partnumber: MCT0603MC1002FP500; Manufacturer: Vishay Beyschlag; Power Rating: 125mW; Resistance: 10kR; Voltage Rating: 75V; NCM: 8533.21.20; Case/Package: 0603; Case Code (Imperial): 0603; Case Code (Metric): 1608; ComponentLink1Description: http://www.mouser.com/ds/2/427/mcat_pro-223602.pdf?src-supplier=Mouser; ComponentLink1URL: http://www.mouser.com/ds/2/427/mcat_pro-223602.pdf?src-supplier=Mouser; ComponentLink2Description: http://www.vishay.com/docs/28760/mcat_pro.pdf?src-supplier=Digi-Key; ComponentLink2URL: http://www.vishay.com/docs/28760/mcat_pro.pdf?src-supplier=Digi-Key; Composition: Thin Film; Height: 0.45mm; Length: 1.6mm; Manufacturer Part Number: MCT0603MC1002FP500; Max Operating Temperature: 155°C; Min Operating Temperature: -55°C; Package Quantity: 5000; Packaging: Tape and Reel; Pricing 1: 1=0.35, 10=0.258, 100=0.113, 500=0.102, 1000=0.051, 2500=0.046 (USD); Pricing 2: 1=0.35, 10=0.298, 100=0.1164, 1000=0.04871, 2500=0.04465 (USD); Stock 1: 17645; Stock 2: 63961; Supplier 1: Mouser; Supplier 2: Digi-Key; Supplier Part Number 1: 594-MCT0603MC1002FP5; Supplier Part Number 2: MCT0603-10.0K-MFCT-ND; Termination: SMD/SMT; Tolerance: 1%; Weight: 7.1E-05oz; Width: 0.8mm
R80 = R1.0k_1%_1/8W_0603: RES 1.0K OHM 1/8W 1% 0603; Partnumber: MCT06030C1001FP500; Manufacturer: Vishay; Resistance: 1kR; Temperature Coefficient: 50ppm/°C; Power Rating: 100mW; Voltage Rating: 75V; Max Power Dissipation: 125mW; NCM: 8533.21.20; Supplier 1: Mouser; Supplier Part Number 1: 594-MCT06030C1001FP5; Stock 1: 142157; Pricing 1: 1=0.1, 1000=0.025, 2000=0.023, 5000=0.019, 10000=0.018, 20000=0.017 (USD); Mount: Surface Mount; Case/Package: 0603; Weight: 7.1E-05oz; Contact Plating: Tin; Case Code (Metric): 1608; Case Code (Imperial): 0603; Min Operating Temperature: -55°C; Max Operating Temperature: 125°C; Tolerance: 1%; Composition: Thin Film; Package Quantity: 1; Packaging: Tape and Reel; Number of Terminations: 2; Termination: SMD/SMT; Military Standard: Not; Voltage Rating (DC): 75V; Length: 1.55mm; Height: 0.022inch; Width: 0.033inch; Depth: 0.85mm; Radiation Hardening: No; REACH SVHC: Unknown; Lead Free: Lead Free; ComponentLink1URL: http://www.vishay.com/docs/28705/mcx0x0xpro.pdf?src-supplier=Digi-Key; ComponentLink1Description: http://www.vishay.com/docs/28705/mcx0x0xpro.pdf?src-supplier=Digi-Key; ComponentLink2URL: http://www.vishay.com/docs/28705/mc_pro.pdf?src-supplier=Avnet+Europe; ComponentLink2Description: http://www.vishay.com/docs/28705/mc_pro.pdf?src-supplier=Avnet+Europe; ComponentLink3URL: http://www.vishay.com/docs/28705/mc_pro.pdf?src-supplier=Avnet; ComponentLink3Description: http://www.vishay.com/docs/28705/mc_pro.pdf?src-supplier=Avnet; ComponentLink4URL: http://www.vishay.com/docs/28705/mc_pro.pdf?src-supplier=Future+Electronics; ComponentLink4Description: http://www.vishay.com/docs/28705/mc_pro.pdf?src-supplier=Future+Electronics; Supplier 2: Digi-Key; Supplier Part Number 2: MCT0603-1.00K-CFCT-ND; Stock 2: 268907; Pricing 2: 1=0.17, 10=0.145, 100=0.0568, 1000=0.02376, 2500=0.02178 (USD); Manufacturer Part Number: MCT06030C1001FP500
SYSTEM_FAULT = LED/R_0602: Red 625nm LED Indication - Discrete 2V 0603 (1608 Metric); NCM: 8541.40.21; Partnumber: 150060RS75000
SYSTEM_ON = LED/R_0603: SMD Red LED; Partnumber: LTST-C191KFKT; Manufacturer: Vishay Lite-On; Dominant Wavelength: 605nm; Forward Current: 30mA; Forward Voltage: 2V; Illumination Color: Orange; Lens Color: Colorless; Lens Style: Diffused,Colorless,Rectangular; Lens Transparency: Clear; Luminous Intensity: 90mcd; Number of Elements: 1; Power Dissipation: 75mW; Reverse Voltage: 5V; Test Current: 20mA; Viewing Angle: 130°; Wavelength: 611nm; NCM: 8541.40.21; Case/Package: 0603; Case Code (Imperial): 0603; Case Code (Metric): 1608; Color: Orange; ComponentLink1Description: http://optoelectronics.liteon.com/upload/download/DS22-2000-222/LTST-C191KFKT.pdf?src-supplier=Digi-Key; ComponentLink1URL: http://optoelectronics.liteon.com/upload/download/DS22-2000-222/LTST-C191KFKT.pdf?src-supplier=Digi-Key; ComponentLink2Description: http://www.mouser.com/ds/2/239/liteon_ltst-c191gkt-371200.pdf?src-supplier=Mouser; ComponentLink2URL: http://www.mouser.com/ds/2/239/liteon_ltst-c191gkt-371200.pdf?src-supplier=Mouser; ComponentLink3Description: https://www.verical.com/server-webapp/html/getDatasheet?partID=631075&src-supplier=Verical; ComponentLink3URL: https://www.verical.com/server-webapp/html/getDatasheet?partID=631075&src-supplier=Verical; Depth: 0.8mm; Height: 0.55mm; Lead Free: Lead Free; Length: 1.6mm; Manufacturer Part Number: LTST-C191KFKT; Max Operating Temperature: 85°C; Min Operating Temperature: -55°C; Mount: Surface Mount; Number of LEDs: 1; Number of Pins: 2; Package Quantity: 1; Packaging: Tape and Reel; Power Rating: 75mW; Pricing 1: 1=0.25, 10=0.13, 100=0.061, 1000=0.045, 5000=0.038, 10000=0.034 (USD); Pricing 2: 1=0.24, 10=0.179, 100=0.0846, 500=0.0564, 1000=0.04418, 2500=0.04324 (USD); Radiation Hardening: No; Stock 1: 15603; Stock 2: 8670; Supplier 1: Mouser; Supplier 2: Digi-Key; Supplier Part Number 1: 859-LTST-C191KFKT; Supplier Part Number 2: 160-1445-1-ND; Width: 0.8mm
U12 = MSP430F6659IPZR: Imported; Manufacturer: Texas Instruments; CompType: IC; PIN_COUNT: 100; Core Architecture: CPUXV2; Data Bus Width: 16b; Frequency: 20MHz; Interface: SPI,USB,UART,I2C,IrDA,USART,SCI; Max Supply Voltage: 3.6V; Memory Size: 512KB; Memory Type: FLASH; Min Supply Voltage: 1.8V; Number of A/D Converters: 16; Number of I/Os: 74; Number of Timers/Counters: 4; Number of UART Channels: 3; Oscillator Type: Internal; Peripherals: Brown-out Detect/Reset,POR,PWM,WDT,DMA,LCD; RAM Size: 66KB; Watchdog Timer: Yes; Application_BuildNumber: *; PartNumber: MSP430F6659IPZR; Alternate PartNumber: MSP430F6659IPZ; PackageReference: PZ0100A; MountType: SMT; RoHS: Y; RefDes: RefDes; Type: DEV; Value: Value; Case/Package: LQFP; ComponentLink1Description: http://www.ti.com/general/docs/lit/getliterature.tsp?genericPartNumber=MSP430F6659&&fileType=pdf&src-supplier=Element14; ComponentLink1URL: http://www.ti.com/general/docs/lit/getliterature.tsp?genericPartNumber=MSP430F6659&&fileType=pdf&src-supplier=Element14; Lead Free: Lead Free; Manufacturer Part Number: MSP430F6659IPZ; Max Frequency: 20MHz; Max Operating Temperature: 85°C; Min Operating Temperature: -40°C; Mount: Surface Mount; Number of Pins: 100; Number of Programmable I/O: 74; Package Quantity: 90; Packaging: Tray; Pricing 1: 1=13.59, 10=12.49, 25=11.97, 100=10.55, 250=10.03, 500=9.39 (USD); Pricing 2: 1=13.59, 10=12.487, 25=11.9696, 100=10.5461, 250=10.02852, 500=9.3815, 1000=8.6051, 2500=8.2816, 5000=8.0228 (USD); REACH SVHC: No SVHC; Stock 1: 288; Stock 2: 457; Supplier 1: Mouser; Supplier 2: Digi-Key; Supplier Part Number 1: 595-MSP430F6659IPZ; Supplier Part Number 2: 296-41521-ND
U13 = REF5025A-Q1: Manufacturer: Texas Instruments; Max Input Voltage: 18V; Max Output Current: 10mA; Max Output Voltage: 2.5V; Min Input Voltage: 2.7V; Nominal Supply Current: 800uA; Operating Supply Current: 1.2mA; Output Type: Fixed; Reference Type: Series; Temperature Coefficient: 3ppm/°C; Tolerance: 0.1%; Partnumber: REF5025AQDRQ1; Case/Package: D; ComponentLink1Description: http://www.ti.com/lit/ds/symlink/ref5025a-q1.pdf?src-supplier=Digi-Key; ComponentLink1URL: http://www.ti.com/lit/ds/symlink/ref5025a-q1.pdf?src-supplier=Digi-Key; Lead Free: Lead Free; Manufacturer Part Number: REF5025AQDRQ1; Max Operating Temperature: 125°C; Min Operating Temperature: -40°C; Min Output Voltage: 2.5V; Number of Pins: 8; Output Current: 10mA; Output Voltage: 2.5V; Package Quantity: 1; Packaging: Tape and Reel; Pricing 1: 1=3.45, 10=3.09, 25=2.93, 100=2.41, 250=2.16, 500=2.08 (USD); Pricing 2: 1=3.44, 10=3.089, 25=2.9204, 100=2.4013, 250=2.15468, 500=2.0768, 1000=1.72634 (USD); Quiescent Current: 800uA; Radiation Hardening: No; Stock 1: 493; Stock 2: 1161; Supplier 1: Mouser; Supplier 2: Digi-Key; Supplier Part Number 1: 595-REF5025AQDRQ1; Supplier Part Number 2: 296-24222-1-ND; Weight: 0.002677oz
U28 = TCA4311ADR: IC SIGNAL BUFFER I2C 8SOIC; Manufacturer: Texas Instruments; Number of Channels: 1; Min Supply Voltage: 2.7V; Max Supply Voltage: 5.5V; Operating Supply Current: 5.1mA; Max Supply Current: 7mA; Max Frequency: 400kHz; Number of Outputs: 2; Partnumber: TCA4311ADR; Supplier 1: Mouser; Supplier Part Number 1: 595-TCA4311ADR; Stock 1: 2408; Pricing 1: 1=2.07, 10=1.75, 100=1.4, 250=1.23, 500=1.19, 1000=0.945 (USD); Mount: Surface Mount; Case/Package: SOIC; Number of Pins: 8; Contact Plating: Gold; Min Operating Temperature: -40°C; Max Operating Temperature: 85°C; Packaging: Tape and Reel; Package Quantity: 1; Interface: I2C; Length: 5mm; Depth: 4mm; Radiation Hardening: No; REACH SVHC: No SVHC; Lead Free: Lead Free; ComponentLink1URL: http://www.ti.com/general/docs/lit/getliterature.tsp?genericPartNumber=TCA4311A&&fileType=pdf&src-supplier=Avnet; ComponentLink1Description: http://www.ti.com/general/docs/lit/getliterature.tsp?genericPartNumber=TCA4311A&&fileType=pdf&src-supplier=Avnet; ComponentLink2URL: http://www.ti.com/lit/ds/symlink/tca4311a.pdf?src-supplier=Avnet+Europe; ComponentLink2Description: http://www.ti.com/lit/ds/symlink/tca4311a.pdf?src-supplier=Avnet+Europe; ComponentLink3URL: http://www.ti.com/lit/ds/symlink/tca4311a.pdf?src-supplier=Digi-Key; ComponentLink3Description: http://www.ti.com/lit/ds/symlink/tca4311a.pdf?src-supplier=Digi-Key; ComponentLink4URL: https://www.verical.com/server-webapp/html/getDatasheet?partID=424385&src-supplier=Verical; ComponentLink4Description: https://www.verical.com/server-webapp/html/getDatasheet?partID=424385&src-supplier=Verical; ComponentLink5URL: http://www.produktinfo.conrad.com/datenblaetter/1100000-1199999/001187988-da-01-en-IC_BUS_BUFF_I2C_HO_TCA4311ADR_SOIC_8_TID.pdf?src-supplier=Conrad; ComponentLink5Description: http://www.produktinfo.conrad.com/datenblaetter/1100000-1199999/001187988-da-01-en-IC_BUS_BUFF_I2C_HO_TCA4311ADR_SOIC_8_TID.pdf?src-supplier=Conrad; Supplier 2: Digi-Key; Supplier Part Number 2: 296-30189-1-ND; Stock 2: 4307; Pricing 2: 1=2.07, 10=1.855, 25=1.75, 100=1.4, 250=1.225, 500=1.19, 1000=0.945 (USD); Manufacturer Part Number: TCA4311ADR
V1-V4 = R27_5%_1/10W_0805: RES 47k OHM 1/10W 1% 0805; Partnumber: RC0805FR-0747KL; NCM: 8533.21.20
Y1 = XTAL_32MHz_SMD_4-SMD: 32MHz ±10ppm Crystal 10pF 60 Ohm -40°C ~ 125°C; Manufacturer: Abracon; ESR (Equivalent Series Resistance): 60R; Tolerance: 50ppm; Frequency Stability: 25ppm; Partnumber: ABM8X-102-32.000MHZ-T; NCM: 8541.60.10; Supplier 1: Mouser; Supplier Part Number 1: 815-ABM8X-102-32.0-T; Stock 1: 365; Pricing 1: 1=6.08, 10=5.86, 25=5.68, 50=5.51, 100=5.35, 250=5.19 (USD); Mount: Surface Mount; Case/Package: SMD/SMT; Min Operating Temperature: -40°C; Max Operating Temperature: 125°C; Frequency: 32MHz; Load Capacitance: 10pF; Package Quantity: 1000; Packaging: Tape and Reel; Frequency Tolerance: 10ppm; Termination: SMD/SMT; Composition: Ceramic; Length: 0.126inch; Height: 0.024inch; Width: 2.5mm; ComponentLink1URL: http://www.mouser.com/ds/2/3/ABM8X-39996.pdf?src-supplier=Mouser; ComponentLink1Description: http://www.mouser.com/ds/2/3/ABM8X-39996.pdf?src-supplier=Mouser; ComponentLink2URL: http://abracon.com/Resonators/ABM8X.pdf?src-supplier=Digi-Key; ComponentLink2Description: http://abracon.com/Resonators/ABM8X.pdf?src-supplier=Digi-Key; Supplier 2: Digi-Key; Supplier Part Number 2: 535-11454-1-ND; Stock 2: 689; Pricing 2: 1=6.22, 10=5.864, 50=5.6866, 100=5.5089, 500=5.15344 (USD)
Y2 = Xtal_32.768kHz_12pF_2_SMD: 32.768kHz ±20ppm Crystal 12.5pF 70 kOhm -40°C ~ 125°C; Partnumber: ECS-.327-12.5-34S-TR; Manufacturer: ECS International; ESR (Equivalent Series Resistance): 70kR; NCM: 8541.60.10; Case/Package: SMD/SMT; ComponentLink1Description: http://www.ecsxtal.com/store/pdf/ECX_34S.pdf?src-supplier=Digi-Key; ComponentLink1URL: http://www.ecsxtal.com/store/pdf/ECX_34S.pdf?src-supplier=Digi-Key; ComponentLink2Description: http://www.ecsxtal.com/store/pdf/partnumber4.pdf?src-supplier=Digi-Key; ComponentLink2URL: http://www.ecsxtal.com/store/pdf/partnumber4.pdf?src-supplier=Digi-Key; Frequency: 32.768kHz; Frequency Tolerance: 20ppm; Height: 0.035inch; Lead Free: Lead Free; Lead Pitch: 1.8mm; Length: 0.126inch; Load Capacitance: 12.5pF; Manufacturer Part Number: ECS-.327-12.5-34S-TR; Max Operating Temperature: 125°C; Min Operating Temperature: -40°C; Mount: Surface Mount; Number of Pins: 2; Package Quantity: 3000; Packaging: Tape and Reel; Pricing 1: 1=1.25, 10=1.11, 50=1.04, 100=0.913, 500=0.864, 1000=0.72 (USD); Pricing 2: 1=1.07, 10=0.944, 50=0.8828, 100=0.7802, 500=0.73918, 1000=0.61598 (USD); Stock 1: 9496; Stock 2: 16165; Supplier 1: Mouser; Supplier 2: Digi-Key; Supplier Part Number 1: 520-ECS32.7-12.534ST; Supplier Part Number 2: XC1967CT-ND; Termination: SMD/SMT; Tolerance: 20ppm; Width: 1.5mm